# EAGLE design mavroOBD (EAGLE 7.5.0)
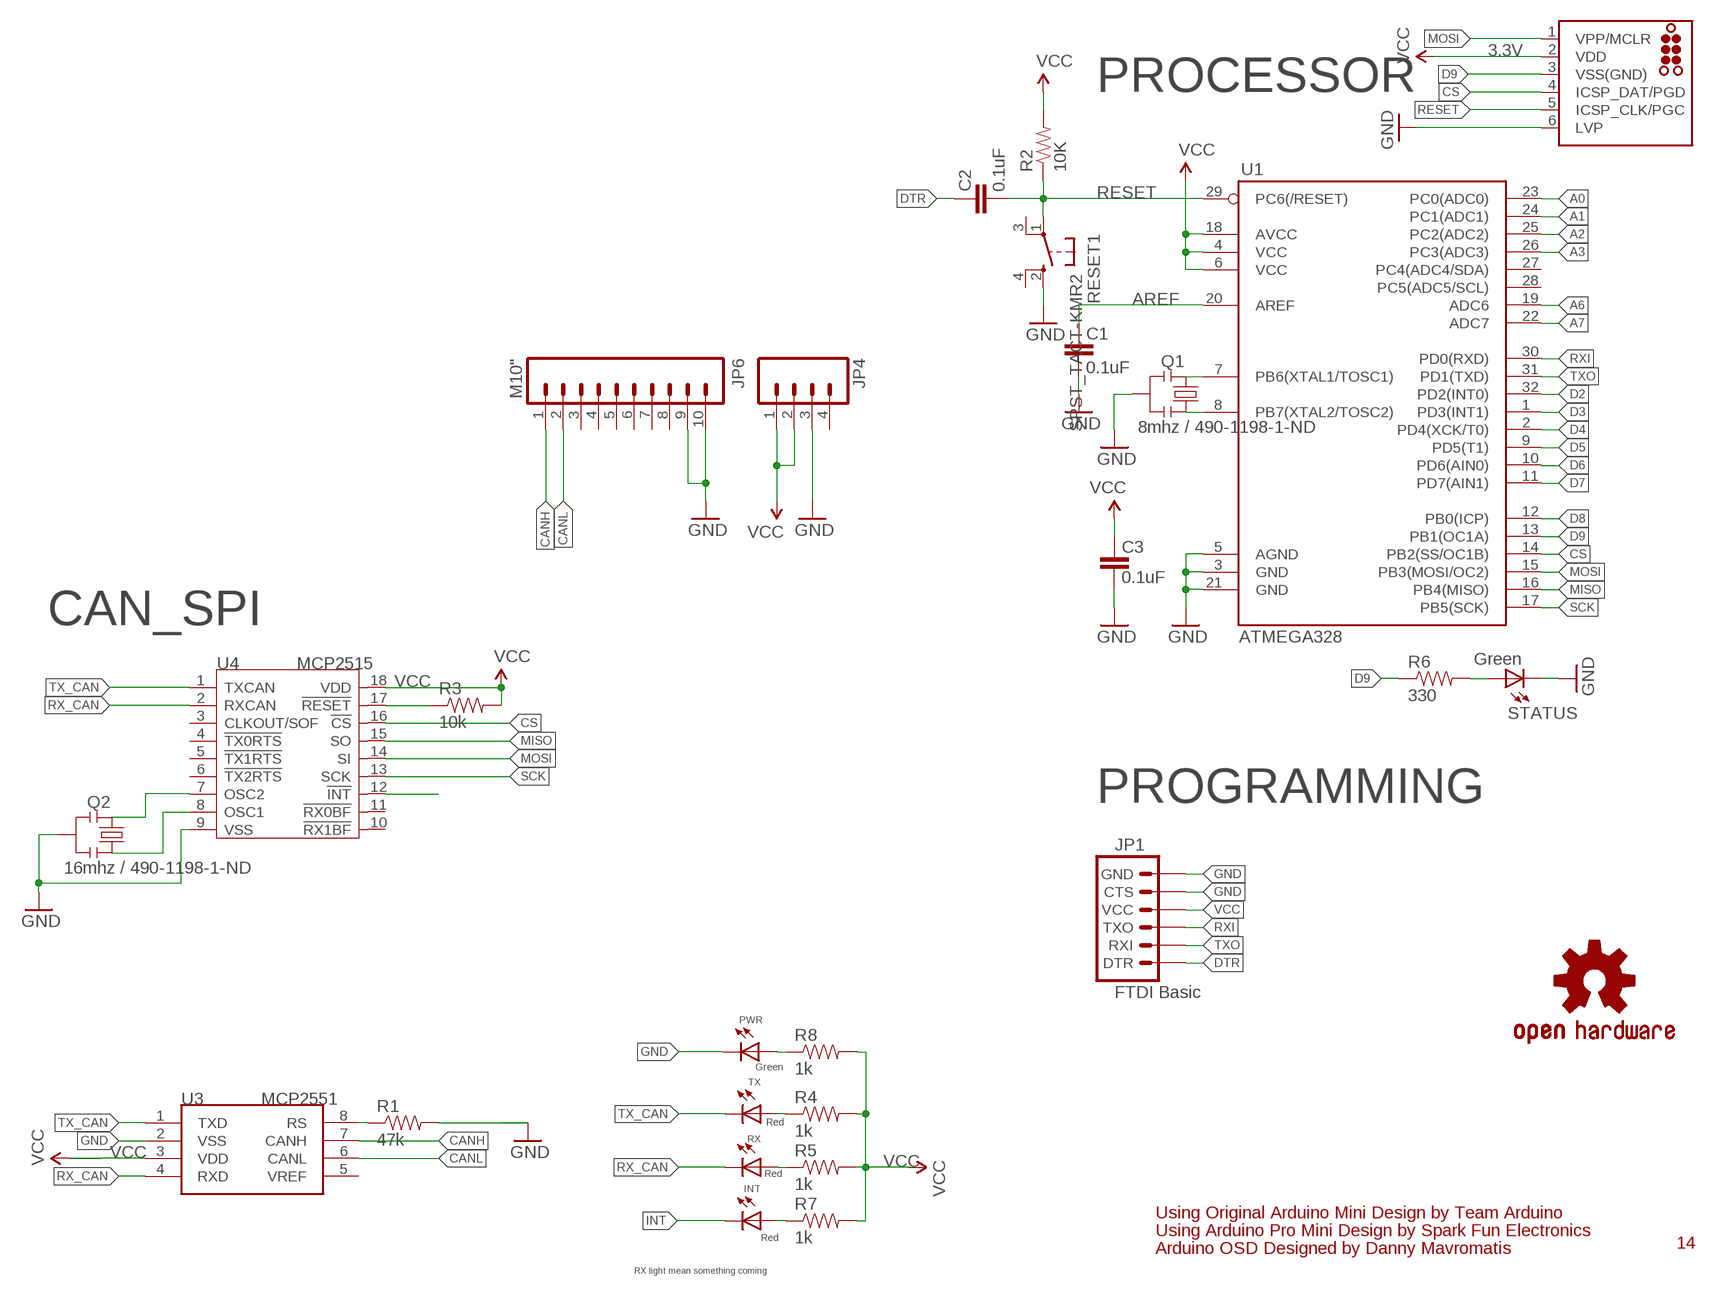
[diagram p0: schematic, sheet 1]

## Parts
C1  0.1uF  CAP0603-CAP  [0603-CAP]
C2  0.1uF  CAP0603-CAP  [0603-CAP]
C3  0.1uF  CAP0603-CAP  [0603-CAP]
INT  Red  LED  [0603-LED-ALT1]
J1  TC2030-MCP-NL  [TC2030-MCP-NL]
JP1  FTDI Basic  ARDUINO_SERIAL_PROGRAMPTH  [1X06]
JP4  M04PTH  [1X04]
JP6  M10"  [1X10]
PWR  Green  LED  [0603-LED-ALT1]
Q1  8mhz / 490-1198-1-ND  RESONATOR1:1  [RESONATOR-SMD-1:1]
Q2  16mhz / 490-1198-1-ND  RESONATOR1:1  [RESONATOR-SMD-1:1]
R1  47k  RESISTOR0603-RES  [0603-RES]
R2  10K  RESISTOR0603-RES  [0603-RES]
R3  10k  RESISTOR0603-RES  [0603-RES]
R4  1k  RESISTOR0603-RES  [0603-RES]
R5  1k  RESISTOR0603-RES  [0603-RES]
R6  330  RESISTOR0603-RES  [0603-RES]
R7  1k  RESISTOR0603-RES  [0603-RES]
R8  1k  RESISTOR0603-RES  [0603-RES]
RESET1  SPST_TACT-KMR2  [KMR2]
RX  Red  LED  [0603-LED-ALT1]
STATUS  Green  LED  [0603-LED-ALT1]
TX  Red  LED  [0603-LED-ALT1]
U1  ATMEGA328  ATMEGA168  [TQFP32-08]
U3  MCP2551  MCP2551-SOIC8  [SOIC8-6.0]
U4  MCP2515  MCP2515-SOIC18  [SOIC18]
U$3  OSHW-LOGOS  [OSHW-LOGO-S]

## Nets
3.3V [power]: J1.2(VDD) ; supply symbol labelled VCC
A0: U1.23(PC0(ADC0))
A1: U1.24(PC1(ADC1))
A2: U1.25(PC2(ADC2))
A3: U1.26(PC3(ADC3))
A6: U1.19(ADC6)
A7: U1.22(ADC7)
AREF: C1.2 U1.20(AREF)
CANH: JP6.1 U3.7(CANH)
CANL: JP6.2 U3.6(CANL)
CS: J1.4(ICSP_DAT/PGD) U1.14(PB2(SS/OC1B)) U4.16(!CS)
D2: U1.32(PD2(INT0))
D3: U1.1(PD3(INT1))
D4: U1.2(PD4(XCK/T0))
D5: U1.9(PD5(T1))
D6: U1.10(PD6(AIN0))
D7: U1.11(PD7(AIN1))
D8: U1.12(PB0(ICP))
D9: J1.3(VSS(GND)) R6.1 U1.13(PB1(OC1A))
DTR: C2.2 JP1.1(DTR)
GND [power]: C1.1 C3.1 J1.6(LVP) JP1.5(CTS) JP1.6(GND) JP4.3 JP6.9 JP6.10 PWR.C Q1.2 Q2.2 R1.2 RESET1.2(S) STATUS.C U1.3(GND) U1.5(AGND) U1.21(GND) U3.2(VSS) U4.9(VSS)
INT: INT.C U4.12(!INT)
MISO: U1.16(PB4(MISO)) U4.15(SO)
MOSI: J1.1(VPP/MCLR) U1.15(PB3(MOSI/OC2)) U4.14(SI)
N$1: Q1.3 U1.8(PB7(XTAL2/TOSC2))
N$2: Q1.1 U1.7(PB6(XTAL1/TOSC1))
N$3: R4.1 TX.A
N$5: PWR.A R8.1
N$7: R6.2 STATUS.A
N$15: R5.1 RX.A
N$16: Q2.1 U4.7(OSC2)
N$17: Q2.3 U4.8(OSC1)
N$19: INT.A R7.1
N$20: R1.1 U3.8(RS)
RESET: C2.1 J1.5(ICSP_CLK/PGC) R2.1 RESET1.1(P) U1.29(PC6(/RESET))
RST_N: R3.1 U4.17(!RESET)
RX_CAN: RX.C U3.4(RXD) U4.2(RXCAN)
RXI: JP1.3(TXO) U1.30(PD0(RXD))
SCK: U1.17(PB5(SCK)) U4.13(SCK)
TX_CAN: TX.C U3.1(TXD) U4.1(TXCAN)
TXO: JP1.2(RXI) U1.31(PD1(TXD))
VCC: C3.2 JP1.4(VCC) JP4.1 JP4.2 R2.2 R3.2 R4.2 R5.2 R7.2 R8.2 U1.4(VCC) U1.6(VCC) U1.18(AVCC) U3.3(VDD) U4.18(VDD)
Unconnected: JP4.4 JP6.3 JP6.4 JP6.5 JP6.6 JP6.7 JP6.8 RESET1.3(P1) RESET1.4(S1) U1.27(PC4(ADC4/SDA)) U1.28(PC5(ADC5/SCL)) U3.5(VREF) U4.3(CLKOUT/SOF) U4.4(!TX0RTS) U4.5(!TX1RTS) U4.6(!TX2RTS) U4.10(!RX1BF) U4.11(!RX0BF)

## Notes on the sheet
- PROCESSOR
- CAN_SPI
- PROGRAMMING
- Using Original Arduino Mini Design by Team Arduino
- Using Arduino Pro Mini Design by Spark Fun Electronics
- 14
- Arduino OSD Designed by Danny Mavromatis
- RX light mean something coming

## Library data of the parts
C1-C3 = SparkFun:CAP: Capacitor Standard 0603 ceramic capacitor, and 0.1" leaded capacitor.
INT PWR RX STATUS TX = Testing:LED: LEDs Standard schematic elements and footprints for 5mm, 3mm, 1206, and 0603 sized LEDs. 5mm - Spark Fun Electronics SKU : COM-00529 (and others)
J1 = tag-connect:TC2030: TAG-CONNECT ICSP Connector Manufacturer: Tag-Connect <http://www.tag-connect.com> Cable for easy In-Circuit Serial Programming. Designed for Microchip ICD2, suitable for many others. Two variants - one "with legs" (for hands-free fit on PCB) and another "without legs" for quick programming. PAD Description 1 MCLR/Vpp 2 Vdd 3 GND 4 PGD (ISPDAT) 5 PGC (ISPCLK) 6 nc (used for LVP) ©2009 ROFA.cz - modified and updated by Robert Darlington ‹rdarlington@gmail.com›
JP1 = SparkFun:ARDUINO_SERIAL_PROGRAM
JP4 = SparkFun-Connectors:M04: Header 4 Standard 4-pin 0.1" header. Use with straight break away headers (SKU : PRT-00116), right angle break away headers (PRT-00553), swiss pins (PRT-00743), machine pins (PRT-00117), and female headers (PRT-00115). Molex polarized connector foot print use with SKU : PRT-08231 with associated crimp pins and housings. 1MM SMD Version SKU: PRT-10208
JP6 = SparkFun-Connectors:M10: Header 10 Standard 10-pin 0.1" header. Use with straight break away headers (SKU : PRT-00116), right angle break away headers (PRT-00553), swiss pins (PRT-00743), machine pins (PRT-00117), and female headers (PRT-00115).
Q1 Q2 = Testing:RESONATOR: Resonator Small SMD resonator. This is the itty bitty 10/20MHz resonators with built in caps. CSTCE10M0G55 and CSTCE20M0V53. Footprint for SMD has been used in SFE production for years, and does work okay. 1:1 is an attempt to get larger fillets on the sides so it will be easier to inspect these solders in our AOI machine. The pads have been minimized to match the actual metal under the resonator. To see this relation, it includes an image import of the bottom side of the component. Imported to scale on layer 200.
R1 R3-R5 R7 R8 = SparkFun-Passives:RESISTOR: Resistor Basic schematic elements and footprints for 0603, 1206, and PTH resistors.
R2 R6 = SparkFun:RESISTOR: Resistor Basic schematic elements and footprints for 0603, 1206, and PTH resistors.
RESET1 = adafruit:SPST_TACT: SMT 6mm switch, EVQQ2 series http://www.ladyada.net/library/eagle
U1 = SparkFun:ATMEGA168
U3 = IC:MCP2551: High-Speed CAN Transceiver http://ww1.microchip.com/downloads/en/devicedoc/21667f.pdf
U4 = IC:MCP2515: Stand-Alone CAN Controller With SPI Interface
U$3 = SparkFun:OSHW-LOGO: Open Source Hardware Logo This logo indicates the piece of hardware it is found on incorporates a OSHW license and/or adheres to the definition of open source hardware found here: http://freedomdefined.org/OSHW

## Net classes
0 default: width 0.254 mm, drill 0.406 mm, clearance 0.355 mm
1 power: width 0.254 mm, drill 0.711 mm, clearance 0.355 mm to class 0, clearance 0.355 mm
2 gnd: width 0.254 mm, drill 0.711 mm, clearance 0.355 mm to class 0, clearance 0.355 mm to class 1, clearance 0.355 mm

## Board
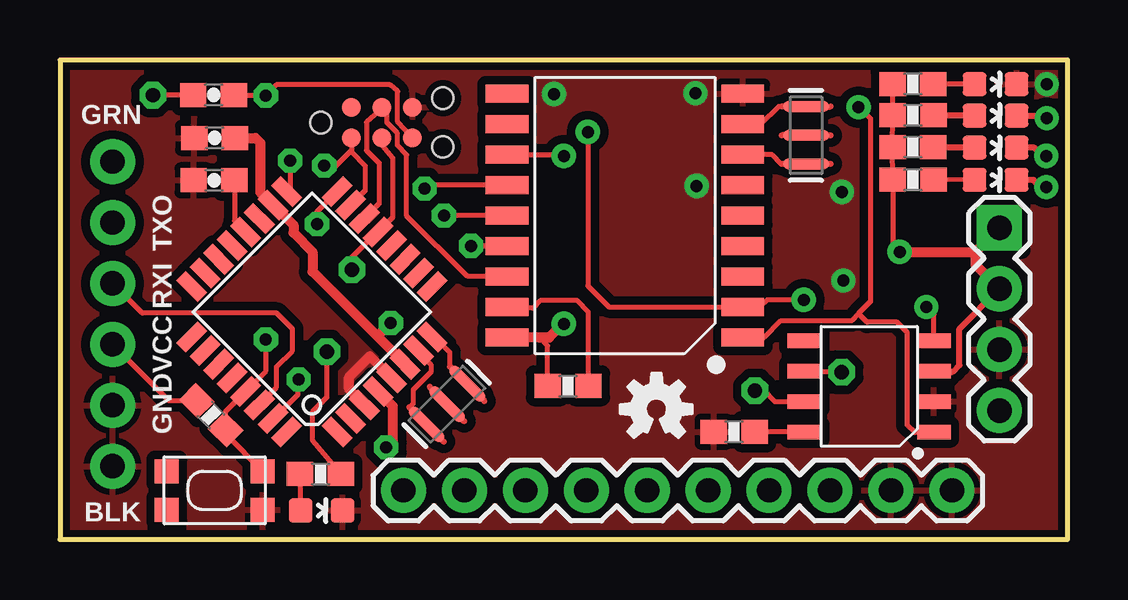
[diagram p1: board, top side]
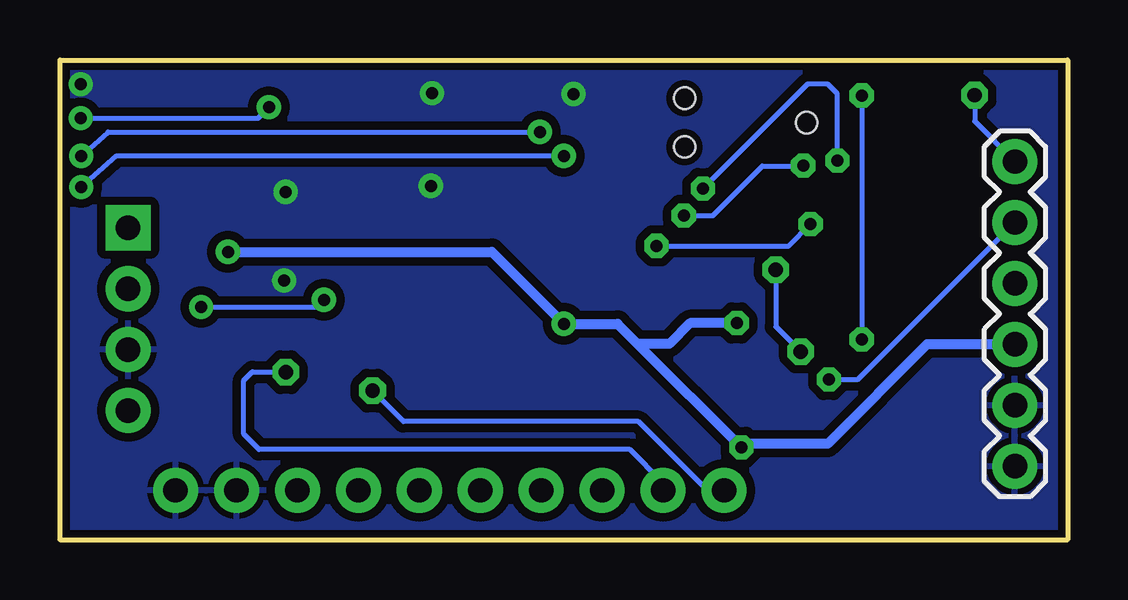
[diagram p2: board, bottom side, seen from below]

Size 42 x 20 mm. Coordinates in mm from the lower left corner, seen from the top.
Outline: 0,20 0,0 42,0 42,20 0,20
Copper layers (1*16): Top 0.035mm / dielectric 1.5mm / Bottom 0.035mm
Design rules "SparkFun-2-layer *": minimum track width 7mil, minimum drill 15mil, track to track 8mil, track to pad 8mil, pad to pad 8mil, via to via 8mil, smd to smd 8mil, copper to edge 8mil, drill to drill 8mil, minimum pad ring 12mil, minimum via ring 10mil, stop-mask expansion 4mil, vias tented up to drill 20mil, thermal gap 10mil

### Footprints (pad centres in the part's own frame; a part is rotated, then mirrored left to right if it is on the bottom)
0603-CAP = smd 1.1 x 1: 1 -0.85,0; 2 0.85,0
0603-LED-ALT1 = smd 1 x 1: A 0,-0.877; C 0,0.877
TC2030-MCP-NL = smd 0.787 x 0.787: 1 1.27,-0.635; 2 1.27,0.635; 3 2.54,-0.635; 4 2.54,0.635; 5 3.81,-0.635; 6 3.81,0.635 | hole 0.889: 0,0; 5.08,-1.016; 5.08,1.016
1X06 = drill 1.016 pad 1.88: 1 0,0; 2 2.54,0; 3 5.08,0; 4 7.62,0; 5 10.16,0; 6 12.7,0
1X04 = drill 1.016 pad 1.88 square: 1 0,0 | drill 1.016 pad 1.88: 2 2.54,0; 3 5.08,0; 4 7.62,0
1X10 = drill 1.016 pad 1.88: 1 0,0; 2 2.54,0; 3 5.08,0; 4 7.62,0; 5 10.16,0; 6 12.7,0; 7 15.24,0; 8 17.78,0; 9 20.32,0; 10 22.86,0
RESONATOR-SMD-1:1 = smd 0.45 x 1.905: 1 -1.2,0; 2 0,0; 3 1.2,0
0603-RES = smd 1.1 x 1: 1 -0.85,0; 2 0.85,0
KMR2 = smd 1 x 1: 1 2,0.8; 2 2,-0.8; 3 -2,0.8; 4 -2,-0.8
TQFP32-08 = smd 1.27 x 0.559: 1 -4.293,2.8; 2 -4.293,2; 3 -4.293,1.2; 4 -4.293,0.4; 5 -4.293,-0.4; 6 -4.293,-1.2; 7 -4.293,-2; 8 -4.293,-2.8; 17 4.293,-2.8; 18 4.293,-2; 19 4.293,-1.2; 20 4.293,-0.4; 21 4.293,0.4; 22 4.293,1.2; 23 4.293,2; 24 4.293,2.8 | smd 0.559 x 1.27: 9 -2.8,-4.293; 10 -2,-4.293; 11 -1.2,-4.293; 12 -0.4,-4.293; 13 0.4,-4.293; 14 1.2,-4.293; 15 2,-4.293; 16 2.8,-4.293; 25 2.8,4.293; 26 2,4.293; 27 1.2,4.293; 28 0.4,4.293; 29 -0.4,4.293; 30 -1.2,4.293; 31 -2,4.293; 32 -2.8,4.293
SOIC8-6.0 = smd 0.6 x 1.4: 1 -1.905,-2.7; 2 -0.635,-2.7; 3 0.635,-2.7; 4 1.905,-2.7; 5 1.905,2.7; 6 0.635,2.7; 7 -0.635,2.7; 8 -1.905,2.7
SOIC18 = smd 0.762 x 1.778: 1 -5.08,-4.915; 2 -3.81,-4.915; 3 -2.54,-4.915; 4 -1.27,-4.915; 5 0,-4.915; 6 1.27,-4.915; 7 2.54,-4.915; 8 3.81,-4.915; 9 5.08,-4.915; 10 5.08,4.915; 11 3.81,4.915; 12 2.54,4.915; 13 1.27,4.915; 14 0,4.915; 15 -1.27,4.915; 16 -2.54,4.915; 17 -3.81,4.915; 18 -5.08,4.915

### Placement (x,y rotation side)
C1  6.42,14.98 0 top
C2  6.4,18.54 180 top
C3  6.45,16.75 0 top
INT  39,15 270 top
J1  10.88,17.39 0 top
JP1  2.19,15.76 270 bottom
JP4  39.16,13 270 top
JP6  14.32,2.05 0 top
PWR  39,18.99 270 top
Q1  16.13,5.65 45 top
Q2  31.1,16.86 90 top
R1  28.1,4.5 180 top
R2  6.3,5.18 135 top
R3  21.18,6.41 180 top
R4  35.56,17.7 180 top
R5  35.55,16.37 180 top
R6  10.86,2.73 180 top
R7  35.56,15.01 180 top
R8  35.55,19 180 top
RESET1  6.45,2.05 0 top
RX  39,16.34 270 top
STATUS  10.91,1.21 270 top
TX  39,17.68 270 top
U1  10.5,9.5 135 top
U3  33.73,6.39 90 top
U4  23.55,13.51 90 top
U$3  24.86,5.44 0 top

### Tracks (layer width: path | path; a pad name or v marks a point on that pad's centre or on a via)
AREF
  Top 0.203: C1.2 7.27,13.29 U1.20
CANH  (via drill 0.6)
  Top 0.203: v28.97,6.21 29.34,6.21 29.79,5.76 U3.7
  Bottom 0.203: JP6.1 15.02,2.05 17.89,4.92 27.68,4.92 v28.97,6.21
CANL  (via drill 0.6)
  Top 0.203: v32.59,6.98 31.07,6.98 U3.6
  Bottom 0.203: JP6.2 16.86,2.37 18.25,3.76 33.7,3.76 34.34,4.4 34.34,6.64 33.98,7 32.61,7 v32.59,6.98
CS
  Top 0.203: U1.14 13.31,14.01 13.31,15.7 12.78,16.22 12.78,17.4 13.42,17.97 J1.4 13.63,17.82 13.63,17.39 14.07,16.94 14.07,16.44 14.45,16.05 14.45,13.49 16.99,10.97 U4.16
D9  (via drill 0.6)
  Top 0.203: J1.3 13.42,16.43 13.87,15.91 13.87,13.44 U1.13 13.22,12.82 12.16,11.76 v12.16,11.25 | v11.12,7.84 11.12,5.92 10.52,5.32 10.52,4.14 R6.1
  Bottom 0.203: v12.16,11.25 12.16,8.88 v11.12,7.84
DTR  (via drill 0.6)
  Top 0.203: C2.2 3.88,18.54 v3.87,18.53
  Bottom 0.203: v3.87,18.53 3.87,17.44 JP1.1
GND  (via drill 0.5)
  Top 0.406: U1.3 12.69,5.63 12.06,6.26 12.06,6.79 12.92,7.65 U1.5
  other vias: 41.13,18.99 32.6,14.5 32.65,10.8 26.49,18.61 26.54,14.75 20.6,18.58
  pour Top (isolate 0.305): 0,20 42,20 42,0 0,0
  pour Bottom (isolate 0.305): 0,20 42,20 42,0 0,0
INT  (via drill 0.5)
  Top 0.203: U4.12 20.95,16.05 v21,16 | 39.93,14.7 INT.C
  Top 0.254: v41.11,14.7 40.88,14.7 40.58,15 INT.C
  Bottom 0.203: v21,16 39.65,16 v41.11,14.7
MISO  (via drill 0.5)
  Top 0.203: U4.15 v17.14,12.24 v17.13,12.25 | v10.71,13.15 10.71,13.67 U1.16
  Bottom 0.203: v17.13,12.25 11.61,12.25 v10.71,13.15
MOSI  (via drill 0.5)
  Top 0.203: J1.1 12.15,16.24 | 12.15,16.24 12.15,16.15 12.72,15.58 12.72,14.55 U1.15 | U4.14 v16,13.51 | v11.02,15.59 11.23,15.32 12.15,16.24
  Bottom 0.203: v16,13.51 14.79,13.51 12.72,15.58 v11.03,15.58 v11.02,15.59
N$1
  Top 0.203: U1.8 15.61,8.45 16.24,7.81 16.24,7.24 16.26,7.22
N$2
  Top 0.203: U1.7 14.95,7.81 15.46,7.3 15.46,6.98 14.72,6.24 14.72,5.68 14.56,5.52
N$3
  Top 0.203: 36.42,17.53 R4.1
  Top 0.254: TX.A 36.43,17.68 R4.1
N$5
  Top 0.203: PWR.A R8.1
N$7
  Top 0.203: 10.23,1.17 STATUS.A 10.01,1.24 R6.2
N$15
  Top 0.203: 36.42,16.08 R5.1
  Top 0.254: RX.A 36.43,16.34 R5.1
N$16
  Top 0.203: 30.08,15.66 29.69,16.05 U4.7
N$17
  Top 0.203: 30.08,18.06 29.96,18.06 29.22,17.32
  Top 0.254: U4.8 29.22,17.32
N$19
  Top 0.203: INT.A R7.1
N$20
  Top 0.203: U3.8 28.96,4.49 R1.1
RESET  (via drill 0.5)
  Top 0.203: C2.1 7.27,18.52 v8.58,18.52 9.02,18.96 13.76,18.96 14.08,18.69 14.08,17.42 J1.5 | v8.58,8.35 v8.59,8.36 8.59,7.04 7.75,6.2 U1.29 6.9,5.34 R2.1 6.9,4.4 RESET1.1
  Bottom 0.203: v8.58,18.52 v8.58,8.35
RST_N
  Top 0.203: R3.1 22.03,9.5 21.57,9.96 20.02,9.96 19.71,9.65 18.68,9.65 U4.17
RX_CAN  (via drill 0.5)
  Top 0.203: v22,17 22,10.58 22.88,9.7 U4.2 29,9.7 | 29,9.7 29.18,9.7 29.48,10 v31,10 | 29.05,9.75 29,9.7 | U3.4 36.43,9.39 v36.12,9.7
  Top 0.254: v41.11,16 40.96,16 40.62,16.34 RX.C
  Bottom 0.203: v41.11,16 40,17 v22,17 | v36.12,9.7 31.3,9.7 v31,10
RXI
  Top 0.203: U1.30 8.31,5.63 9.03,6.35 9.03,7.21 9.69,7.87 9.69,8.79 9.04,9.44 3.43,9.44 JP1.3
SCK  (via drill 0.5)
  Top 0.203: U4.13 15.34,14.78 v15.2,14.64 | v9.6,15.8 9.6,14.67 U1.17
  Bottom 0.203: v9.6,15.8 9.6,18.6 10,19 10.84,19 v15.2,14.64
TX_CAN  (via drill 0.5)
  Top 0.203: U4.1 29.36,8.43 30.06,9.13 33,9.13 33.29,9.42 | U3.1 36.41,4.46 35.63,4.46 35.32,4.77 35.32,8.64 34.89,9.07 33.64,9.07 33.29,9.42 | 41.09,17.53 v41.13,17.57 | v33.29,18.03 33.32,18.03 33.79,17.56 33.79,9.92 33.29,9.42
  Top 0.254: 41.09,17.53 40.81,17.53 40.68,17.66 39.9,17.66 TX.C
  Bottom 0.203: v41.13,17.57 33.75,17.57 v33.29,18.03
TXO  (via drill 0.5)
  Top 0.203: U1.31 8.92,5.05 9.92,6.05 9.92,6.65 v9.95,6.68
  Bottom 0.203: v9.95,6.68 8.73,6.68 JP1.2
VCC  (via drill 0.5)
  Top 0.203: 34.72,14.67 R7.2 | R7.2 R5.2 R4.2 34.71,18.99 R8.2 | R7.2 34.71,12.29 v35,12 | U4.18 18.64,8.27 | R3.2 20.33,8.09 20,8.42 | R2.2 4.55,5.78 JP1.4
  Top 0.254: 37,7 37.21,7 37.49,7.28 37.49,8.79 JP4.2
  Top 0.406: 37,7 36.45,7 U3.3 | v21,9 20.97,9 20.39,8.42 20,8.42 U4.18 | U1.4 13.87,5.57 13.87,4.11 v13.6,3.84 | C3.2 8.15,16.75 8.35,16.55 8.35,14.48 U1.18 8.9,13.95 9.73,13.12 9.73,12.8 10.53,12 10.53,11.17 U1.6 13.24,8.46 13.24,8.48 v13.79,9.03 | v35,12 38.16,12 | 38.16,12 JP4.1 | 38.16,12 38.16,11.46 JP4.2
  Bottom 0.406: v35,12 24,12 v21,9 18.76,9 17.92,8.16 | JP1.4 5.86,8.14 10,4 13.16,4 v13.6,3.84 17.92,8.16 | v13.79,9.03 15.73,9.03 16.6,8.16 17.92,8.16

### Text on the board
tPlace: GRN | TXO | RXI | VCC | GND | BLK